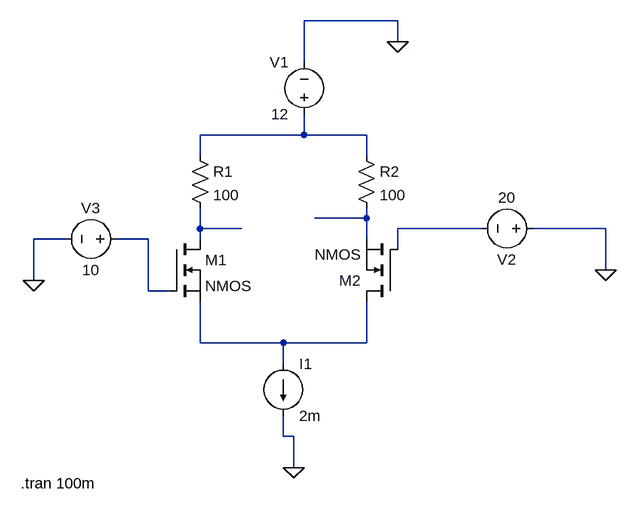
[diagram p0: schematic Differential_amplifier.asc]
Differential_amplifier.asc, the LTspice schematic file:
Version 4
SHEET 1 880 680
WIRE 352 -160 208 -160
WIRE 352 -128 352 -160
WIRE 208 -96 208 -160
WIRE 208 16 208 -16
WIRE 208 16 48 16
WIRE 304 16 208 16
WIRE 48 48 48 16
WIRE 304 48 304 16
WIRE 304 144 304 128
WIRE 304 144 224 144
WIRE 48 160 48 128
WIRE 112 160 48 160
WIRE 480 160 352 160
WIRE 672 160 560 160
WIRE -160 176 -208 176
WIRE -32 176 -80 176
WIRE 48 176 48 160
WIRE 304 176 304 144
WIRE 352 192 352 160
WIRE 672 224 672 160
WIRE -208 240 -208 176
WIRE -32 256 -32 176
WIRE 0 256 -32 256
WIRE 48 336 48 272
WIRE 176 336 48 336
WIRE 304 336 304 272
WIRE 304 336 176 336
WIRE 176 368 176 336
WIRE 176 480 176 448
WIRE 192 480 176 480
WIRE 192 528 192 480
FLAG -208 240 0
FLAG 192 528 0
FLAG 352 -128 0
FLAG 672 224 0
SYMBOL nmos 0 176 R0
SYMATTR InstName M1
SYMBOL res 32 32 R0
SYMATTR InstName R1
SYMATTR Value 100
SYMBOL res 288 32 R0
SYMATTR InstName R2
SYMATTR Value 100
SYMBOL current 176 368 R0
WINDOW 123 0 0 Left 0
WINDOW 39 0 0 Left 0
SYMATTR InstName I1
SYMATTR Value 2m
SYMBOL voltage 208 0 R180
WINDOW 0 24 96 Left 2
WINDOW 3 24 16 Left 2
WINDOW 123 0 0 Left 0
WINDOW 39 0 0 Left 0
SYMATTR InstName V1
SYMATTR Value 12
SYMBOL voltage 576 160 R90
WINDOW 0 32 56 VTop 2
WINDOW 3 -32 56 VBottom 2
WINDOW 123 0 0 Left 0
WINDOW 39 0 0 Left 0
SYMATTR InstName V2
SYMATTR Value 20
SYMBOL voltage -64 176 R90
WINDOW 0 -32 56 VBottom 2
WINDOW 3 32 56 VTop 2
WINDOW 123 0 0 Left 0
WINDOW 39 0 0 Left 0
SYMATTR InstName V3
SYMATTR Value 10
SYMBOL nmos 352 272 R180
SYMATTR InstName M2
TEXT -228 552 Left 2 !.tran 100m

The netlist it stands for:
* Differential_amplifier.asc
M1 N003 N005 N006 N006 NMOS
R1 N001 N003 100
R2 N001 N002 100
I1 N006 0 2m
V1 N001 0 12
V2 0 N004 20
V3 N005 0 10
M2 N006 N004 N002 N002 NMOS
.model NMOS NMOS
.model PMOS PMOS
.lib standard.mos
.tran 100m
.backanno
.end